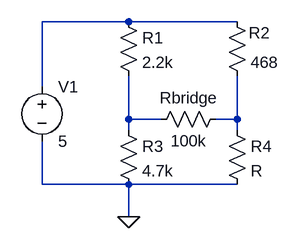
[diagram p0: schematic Draft2.asc]
Draft2.asc, the LTspice schematic file:
Version 4
SHEET 1 880 680
WIRE 160 48 32 48
WIRE 320 48 160 48
WIRE 32 144 32 48
WIRE 160 192 160 128
WIRE 208 192 160 192
WIRE 320 192 320 128
WIRE 320 192 288 192
WIRE 160 208 160 192
WIRE 320 208 320 192
WIRE 32 288 32 224
WIRE 160 288 32 288
WIRE 320 288 160 288
WIRE 160 336 160 288
FLAG 160 336 0
SYMBOL res 144 32 R0
SYMATTR InstName R1
SYMATTR Value 2.2k
SYMBOL res 304 32 R0
WINDOW 0 33 32 Left 2
SYMATTR InstName R2
SYMATTR Value 468
SYMBOL res 144 192 R0
SYMATTR InstName R3
SYMATTR Value 4.7k
SYMBOL res 304 192 R0
SYMATTR InstName R4
SYMBOL res 304 176 R90
WINDOW 0 0 56 VBottom 2
WINDOW 3 32 56 VTop 2
SYMATTR InstName Rbridge
SYMATTR Value 100k
SYMBOL voltage 32 128 R0
WINDOW 123 0 0 Left 0
WINDOW 39 0 0 Left 0
SYMATTR InstName V1
SYMATTR Value 5

The netlist it stands for:
* Draft2.asc
R1 N001 N002 2.2k
R2 N001 N003 468
R3 N002 0 4.7k
R4 N003 0 R
Rbridge N003 N002 100k
V1 N001 0 5
.backanno
.end